# Altium schematic sheet MOTOR_DRIVE.SchDoc
size A4; DocumentNumber: 4; SheetNumber: 4; SheetTotal: 5
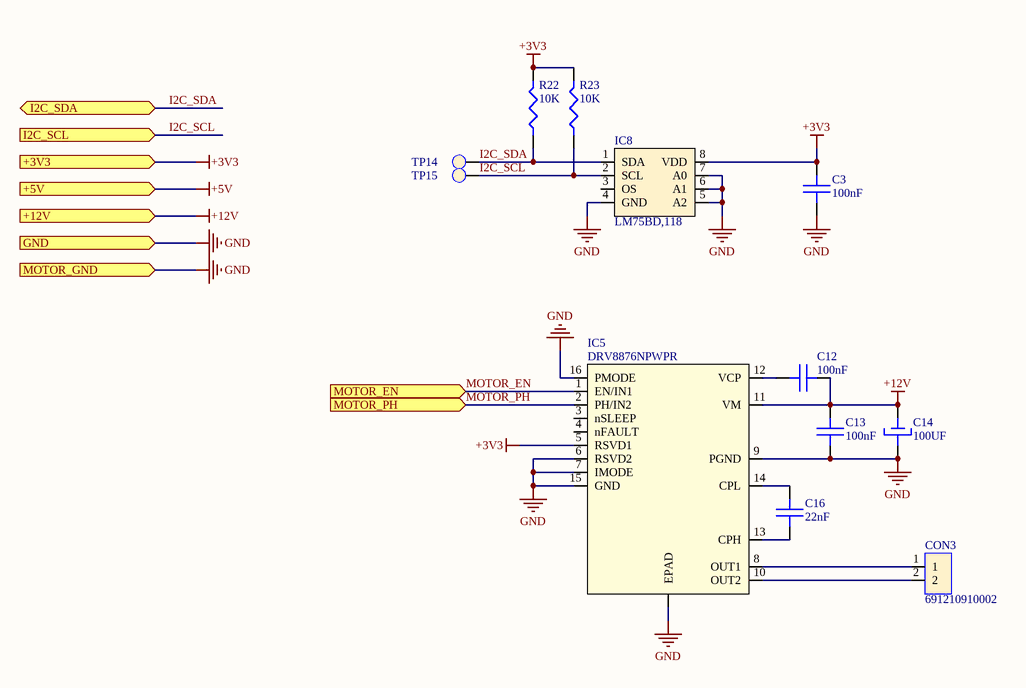
[diagram p0: MOTOR_DRIVE.SchDoc]

## Parts
C3  100nF  [C0402]
C12  100nF  [C0603]
C13  100nF  [C0603]
C14  100UF  [6mm Aliminyum Smd]
C16  22nF  [C0805]
CON3  691210910002  [691210910002]
IC5  DRV8876NPWPR  [HTSSOP16_4P4X5_TEX-M]
IC8  LM75BD,118  [SO08]
R22  10K  [R0402]
R23  10K  [R0402]
TP14  TestPoint1  [SMD_1mmPoint]  (value not drawn)  (no BOM)
TP15  TestPoint1  [SMD_1mmPoint]  (value not drawn)  (no BOM)

## Ports
+3V3 (in), +5V (in), +12V (in), GND (in), I2C_SCL (in), I2C_SDA (bidir), MOTOR_EN (in), MOTOR_GND (in), MOTOR_PH (in)

## Nets
+3V3: C3.2 IC5.5(RSVD1) IC8.8(VDD) R22.2 R23.2 ; port +3V3
+5V: port +5V
+12V: C12.2 C13.2 C14.1 IC5.11(VM) ; port +12V
GND: C3.1 C13.1 C14.2 IC5.6(RSVD2) IC5.7(IMODE) IC5.9(PGND) IC5.15(GND) IC5.16(PMODE) IC5.EPAD IC8.4(GND) IC8.5(A2) IC8.6(A1) IC8.7(A0) ; port GND, port MOTOR_GND
I2C_SCL: IC8.2(SCL) R23.1 TP15.1 ; port I2C_SCL
I2C_SDA: IC8.1(SDA) R22.1 TP14.1 ; port I2C_SDA
MOTOR_EN: IC5.1(EN/IN1) ; port MOTOR_EN
MOTOR_PH: IC5.2(PH/IN2) ; port MOTOR_PH
NetC12_1: C12.1 IC5.12(VCP)
NetC16_1: C16.1 IC5.13(CPH)
NetC16_2: C16.2 IC5.14(CPL)
NetCON3_1: CON3.1 IC5.8(OUT1)
NetCON3_2: CON3.2 IC5.10(OUT2)

Not connected (* = marked no-connect by the designer): IC5 3(nSLEEP) 4(nFAULT); IC8 3(OS)

## Notes on the sheet
- Tarih/Date
- Tasa/Desig
- Kont/Check
- Onay/Appr
- Sayfa/Sht
- Form
- Ortam/Env
- A4
- /
- Deg Tarihi/Chng Date
- Deg Onay/Chng Appr
- Rev
- (c) 2022 by SCSG Elektronik A.Ş.
  All rights Reserved. No part of this document may be produced or transmitted in any form or by any means electronic, mechanical, photocopying, recording, or otherwise, without prior written permission of SCSG.

## Library data of the parts
C3 = CC0402KRX7R6BB104: 100nF ,10V ,X7R ,0402; Manufacturer: Yageo; Value: 100000; Tolerance: 10%; Dielectric Material: Ceramic; Purpose Of Usage: MOTOR; Supplier 1: Digi-Key; Manufacturer Part Number: CC0402KRX7R6BB104; RoHS: YES; Category: CAPASITOR; Mount: SMD; Case/Package: 0402; Case Code (Imperial): 0402; Case Code (Metric): 1005; Min Operating Temperature: -55°C; Max Operating Temperature: 125°C; Voltage Rating: 10V; Voltage Rating (DC): 10V; Dielectric: X7R; Height: 0.5mm; Supplier Part Number 1: 311-1345-1-ND; Sub-Category: CERAMIC; Stock ID: ??; Local Supplier: GENERAL; Price 10K: 0.00250
C12 C13 = CC0603KRX7R8BB104: 100nF, 25V, X7R, 0603; Manufacturer: Yageo; Value: 100000; Tolerance: 10%; Dielectric Material: Ceramic; Purpose Of Usage: MOTOR; Supplier 1: Digi-Key; Supplier Part Number 1: 311-1341-1-ND; Manufacturer Part Number: CC0603KRX7R8BB104; RoHS: YES; Mount: SMD; Case/Package: 0603; Case Code (Imperial): 0603; Case Code (Metric): 1608; Min Operating Temperature: -55°C; Max Operating Temperature: 125°C; Voltage Rating: 25V; Voltage Rating (DC): 25V; Dielectric: X7R; Height: 0.8mm; Category: CAPASITOR; Sub-Category: CERAMIC; Stock ID: ??; Local Supplier: GENERAL; Price 10K: 0.00250
C14 = UWX1C101MCL1GB: 100uF, 16V, ELC, 6.3mm SMD; Manufacturer: Nichicon; Dielectric Material: Aluminium; Value: 100000000; Tolerance: 20%; Dielectric: Polymer; Purpose Of Usage: MOTOR; Supplier 1: Digi-Key; Supplier Part Number 1: 493-2105-1-ND; Manufacturer Part Number: UWX1C101MCL1GB; RoHS: YES; Mount: SMD; Case/Package: Radial; Min Operating Temperature: -40°C; Max Operating Temperature: 85°C; Voltage Rating: 16V; Voltage Rating (DC): 16V; Diameter: 6.3mm; Height: 5.5mm; Category: CAPASITOR; Sub-Category: ALUMINUM; Stock ID: ??; Case Code (Imperial): 6.3 mm; Local Supplier: GENERAL; Price 10K: 0.00250
C16 = CC0805KRX7R9BB223: 22nF, 50 V, X7R, 0805; Manufacturer: Yageo; Dielectric Material: Ceramic; Value: 22000; Tolerance: 10%; Voltage Rating: 50V; Purpose Of Usage: MOTOR; Supplier 1: Digi-Key; Manufacturer Part Number: CC0805KRX7R9BB223; RoHS: YES; Category: CAPASITOR; Case/Package: 0805; Case Code (Metric): 2012; Case Code (Imperial): 0805; Min Operating Temperature: -55°C; Max Operating Temperature: 125°C; Voltage Rating (DC): 50V; Dielectric: X7R; Height: 0.6mm; Supplier Part Number 1: 311-1138-2-ND; Local Supplier: GENERAL; Mount: SMD; Price 10K: 0.00250; Sub-Category: CERAMIC; Stock ID: ??
CON3 = 691210910002: 2.54 Mm Terminal Block, Horizont; Manufacturer: Wurth Electronics; Purpose Of Usage: MOTOR; Supplier 1: Digi-Key; Supplier Part Number 1: 732-691210910002-ND; Manufacturer Part Number: 691210910002; RoHS: No; Category: CONNECTORS; Sub-Category: TERMINAL BLOCK; Stock ID: ??
IC5 = DRV8876NPWPR: 37-V, 3.5-A brushed DC motor driver 16-HTSSOP -40 to 125; Manufacturer: Texas Instruments; Max Supply Voltage: 35V; Min Supply Voltage: 4.5V; Manufacturer Part Number: DRV8876NPWPR; RoHS: Yes; Category: INTEGRATED CIRCUITS; Case/Package: HTSSOP - 16; Lead Free: Lead Free; Max Operating Temperature: 85°C; Min Operating Temperature: -40°C; Mount: SMD; Purpose Of Usage: MOTOR; Stock ID: ??; Sub-Category: MOTOR DRIVER; Supplier 1: Digikey; Supplier Part Number 1: 296-DRV8876NPWPRCT-ND
IC8 = LM75BD,118: LM75 Series 5.5 V I2C Digital Temperature Sensor and Thermal Watchdog - SOIC-8; Manufacturer: NXP Semiconductors; Purpose Of Usage: MOTOR; Manufacturer Part Number: LM75BD,118; RoHS: Yes; Category: SENSOR; Case/Package: SOIC; Min Operating Temperature: -55°C; Max Operating Temperature: 125°C; Stock ID: ??; Mount: SMD; Sub-Category: TEMPERATURE; Supplier 1: Digi-Key; Supplier Part Number 1: 568-4688-1-ND
R22 R23 = RC0402FR-0710KL: 10K, %1, 1/16W, 0402; Manufacturer: YAGEO; Voltage Rating: 50V; Value: 10000; Power Rating: 63mW; Tolerance: 1%; Temperature Coefficient: 100ppm/°C; Purpose Of Usage: MOTOR; Supplier 1: Digi-Key; Manufacturer Part Number: RC0402FR-0710KL; RoHS: YES; Category: RESISTOR; Case/Package: 0402; Case Code (Imperial): 0402; Min Operating Temperature: -55°C; Max Operating Temperature: 155°C; Max Power Dissipation: 63mW; Voltage Rating (DC): 50V; Working Voltage: 50V; Supplier Part Number 1: 311-10.0KLRCT-ND; Stock ID: ??; Mount: SMD; Sub-Category: CHIP RESISTOR; Price 10K: 0.0025; Local Supplier: GENERAL
TP14 TP15 = TestPoint1: test ölçüm noktası; Manufacturer: NO BOM DEVICE; Purpose Of Usage: MOTOR; Category: CONNECTORS; Sub-Category: TEST POINT; Manufacturer Part Number: NO BOM DEVICE; Stock ID: ??